# EAGLE schematic deneme5 (EAGLE 9.6.2)
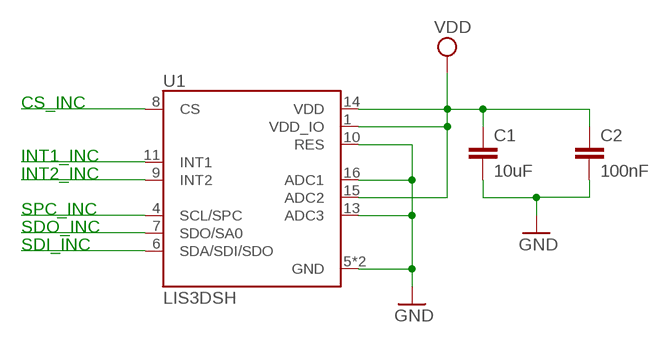
[diagram p0: schematic, sheet 1]

## Parts
C1  10uF  C2,5-3  [C2.5-3]
C2  100nF  C2,5-3  [C2.5-3]
U1  LIS3DSH  [LGA16R50P5X3_300X300X100N]

## Nets
GND: C1.2 C2.2 U1.5(GND) U1.10(RES) U1.12(GND) U1.13(ADC3) U1.16(ADC1)
N$2: U1.4(SCL/SPC)
N$4: U1.6(SDA/SDI/SDO)
N$5: U1.7(SDO/SA0)
N$6: U1.8(CS)
N$7: U1.9(INT2)
N$9: U1.11(INT1)
VDD: C1.1 C2.1 U1.1(VDD_IO) U1.14(VDD) U1.15(ADC2)

## Notes on the sheet
- CS_INC
- INT1_INC
- INT2_INC
- SPC_INC
- SDO_INC
- SDI_INC

## Library data of the parts
C1 C2 = capacitor-wima:C: CAPACITOR naming: grid - package width
U1 = LIS3DSH:LIS3DSH: MEMS digital output motion sensor ultra low-power high performance 3-axes "nano" accelerometer Check prices <https://pricing.snapeda.com/parts/LIS3DSH/STMicroelectronics/view-part?ref=eda>; AVAILABILITY: Bad; DESCRIPTION: Accelerometer X, Y, Z Axis ±2g, 4g, 6g, 8g, 16g 1.56Hz ~ 800Hz 16-LGA (3x3); MF: STMicroelectronics; MP: LIS3DSH; PACKAGE: LGA-16 STMicroelectronics; PRICE: None

## Module PA5
Ports: 

### Library data of the parts